# EAGLE design CC3-MPI-26-3124-Satellite-Board-CoCo-3-Upgrade-2009-V1RA (EAGLE 5.10)
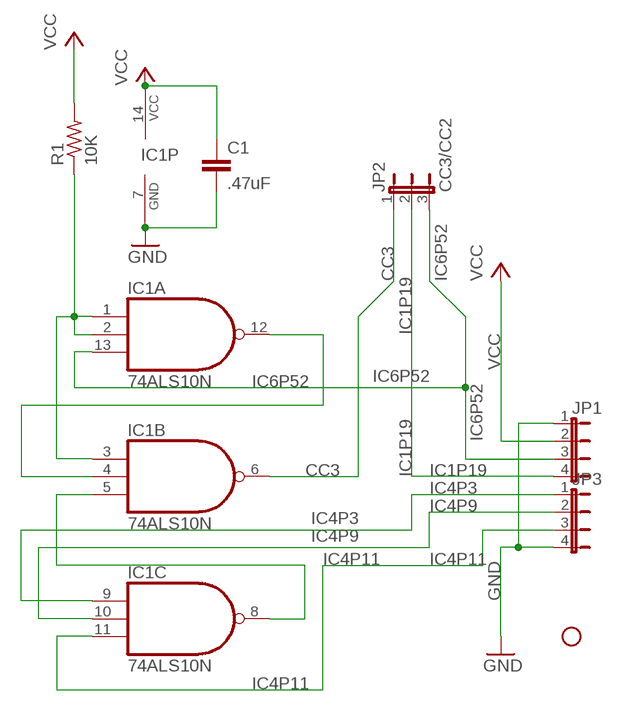
[diagram p0: schematic, sheet 1]

## Parts
C1  .47uF  C2.5/4  [C2.5-4]
IC1  74ALS10N  [DIL14-3]
JP1  JP4E  [JP4]
JP2  CC3/CC2  JP2E  [JP2]
JP3  JP4E  [JP4]
R1  10K  R-US_0207/7  [0207/7]
U$1  SPARKFUN_STAND-OFF  [SPARKFUN_STAND-OFF]

## Nets
CC3: IC1.6(B:O) JP2.1
GND [power]: C1.2 IC1.7(P:GND) JP1.1 JP3.4
IC1P19: JP1.4 JP2.2
IC4P3: IC1.9(C:I0) JP3.1
IC4P9: IC1.10(C:I1) JP3.2
IC4P11: IC1.11(C:I2) JP3.3
IC6P52: IC1.13(A:I2) JP1.3 JP2.3
N$6: IC1.1(A:I0) IC1.2(A:I1) IC1.3(B:I0) R1.1
N$8: IC1.4(B:I1) IC1.12(A:O)
N$9: IC1.5(B:I2) IC1.8(C:O)
VCC [power]: C1.1 IC1.14(P:VCC) JP1.2 R1.2

## Library data of the parts
C1 = capacitor-wima:C: CAPACITOR naming: grid - package width
IC1 = RetroZilla.org-74xx-us:74*10: Triple 3-input NAND gate
JP1 JP3 = jumper:JP4E: JUMPER
JP2 = jumper:JP2E: JUMPER
R1 = rcl-2:R-US_: RESISTOR, American symbol
U$1 = FDC:SPARKFUN_STAND-OFF: Stand Off This is the mechanical footprint for a #4 phillips button head screw. Use the keepout ring to avoid running the screw head into surrounding components. SKU : PRT-00447

## Net classes
0 default: width 0.203 mm, clearance 0.152 mm
1 power: width 0.762 mm, clearance 0.203 mm

## Board
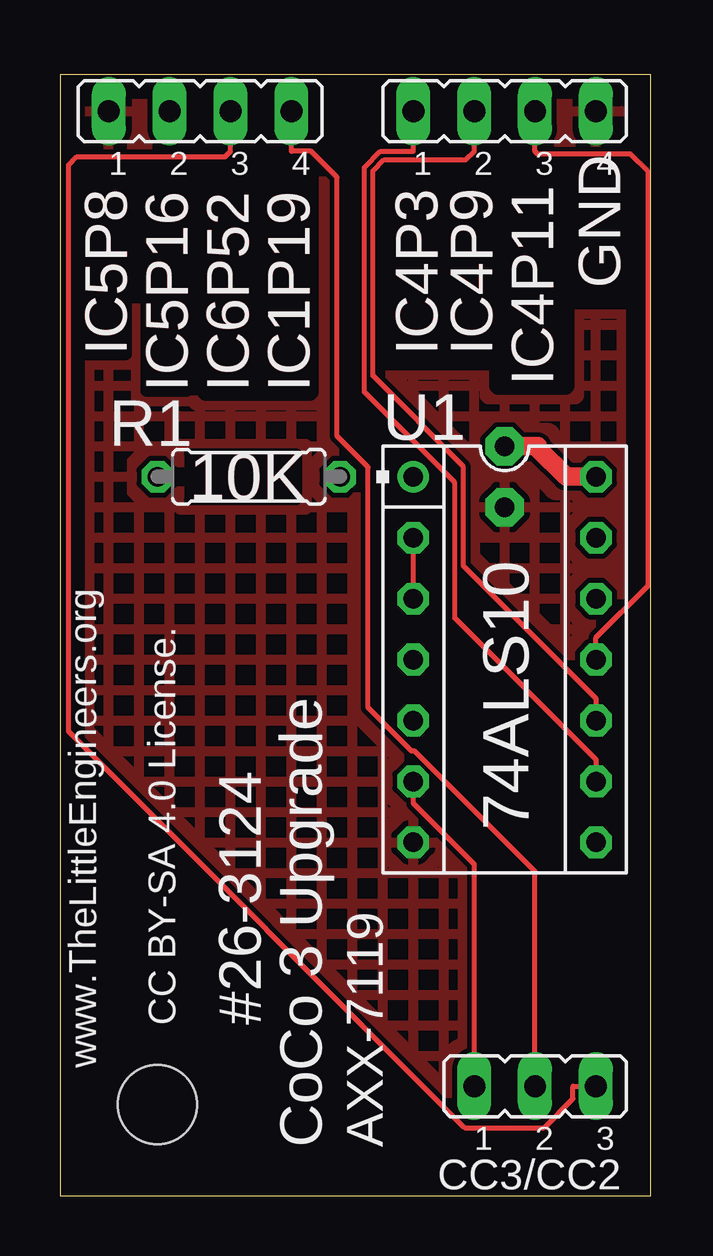
[diagram p1: board, top side]
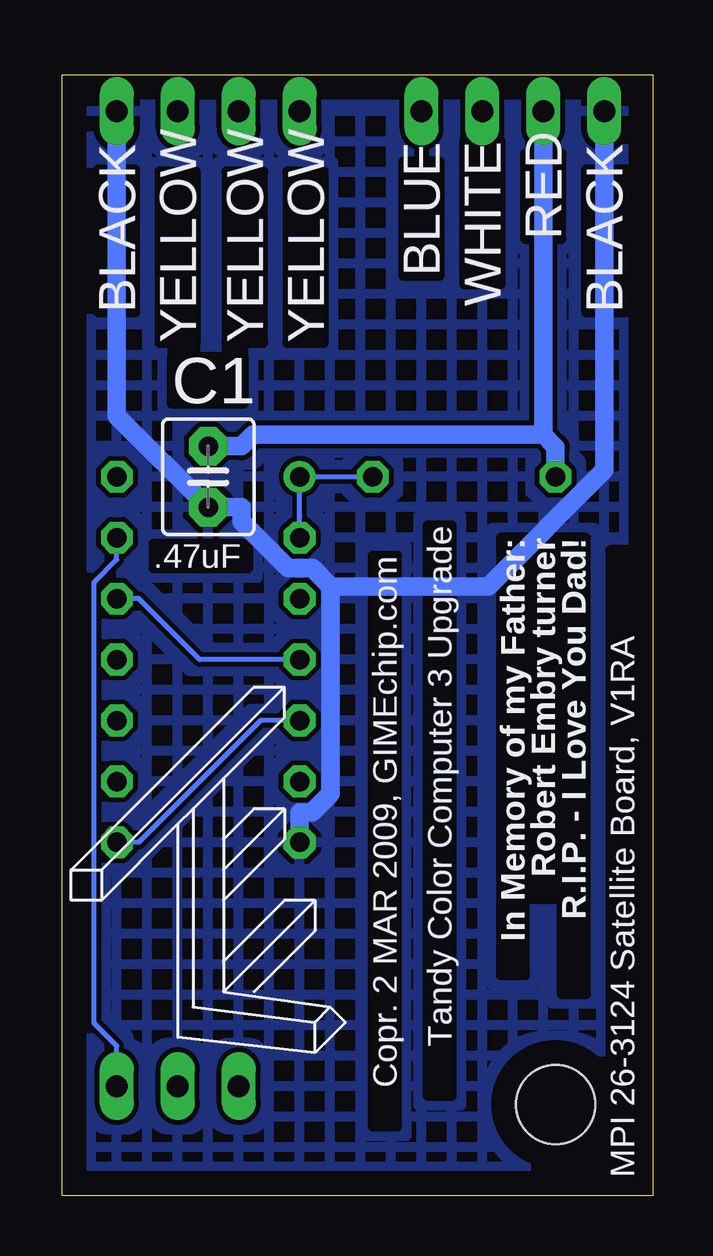
[diagram p2: board, bottom side, seen from below]

Size 24.64 x 46.74 mm. Coordinates in mm from the lower left corner, seen from the top.
Outline: 0,46.74 0,0 24.64,0 24.64,46.74 0,46.74
Copper layers (1*16): Top 0.035mm / dielectric 1.5mm / Bottom 0.035mm
Design rules "default": minimum track width 10mil, minimum drill 24mil, track to track 8mil, track to pad 8mil, pad to pad 8mil, via to via 8mil, smd to smd 8mil, copper to edge 40mil, drill to drill 8mil, minimum pad ring 10mil, minimum via ring 8mil, stop-mask expansion 4mil, vias tented up to drill 0mil, thermal gap 10mil
tRestrict: area 1,33.5 to 10.4,42.7; area 13.7,33.8 to 23.9,42.4

### Footprints (pad centres in the part's own frame; a part is rotated, then mirrored left to right if it is on the bottom)
C2.5-4 = drill 0.813 pad 1.6 octagon: 1 -1.27,0; 2 1.27,0
DIL14-3 = drill 0.813 round: 1 -7.62,-3.81 | drill 0.813 octagon: 2 -5.08,-3.81; 3 -2.54,-3.81; 4 0,-3.81; 5 2.54,-3.81; 6 5.08,-3.81; 7 7.62,-3.81; 8 7.62,3.81; 9 5.08,3.81; 10 2.54,3.81; 11 0,3.81; 12 -2.54,3.81; 13 -5.08,3.81; 14 -7.62,3.81
JP4 = drill 0.914 long: 1 -3.81,0; 2 -1.27,0; 3 1.27,0; 4 3.81,0
JP2 = drill 0.914 long: 1 -2.54,0; 2 0,0; 3 2.54,0
0207/7 = drill 0.813 octagon: 1 -3.81,0; 2 3.81,0
SPARKFUN_STAND-OFF = hole 3.302: 0,0

### Placement (x,y rotation side)
C1  18.54,29.97 270 bottom
IC1  18.54,22.35 270 top
JP1  5.84,45.21 0 top
JP2  19.81,4.57 0 top
JP3  18.54,45.21 0 top
R1  7.87,29.97 180 top
U$1  4.06,3.81 0 top
U$2  [TLE-LOGO-13]  19.81,6.6 0 bottom

### Tracks (layer width: path | path; a pad name or v marks a point on that pad's centre or on a via)
CC3
  Top 0.203: IC1.6 14.73,16.36 17.27,13.82 JP2.1
GND
  Bottom 0.762: 13.44,25.4 13.44,16.76 14.22,15.98 14.73,15.98 IC1.7 | 13.44,25.4 14.19,26.16 15.22,26.16 17.16,28.1 17.16,28.7 C1.2 22.35,32.51 JP3.4 | JP1.1 2.03,30.24 6.87,25.4 13.44,25.4
  pour Top (hatched): -0.51,47.75 24.89,47.75 24.89,-0.51 -0.51,-0.51
  pour Bottom (hatched): -0.51,47.75 24.89,47.75 24.89,-0.51 -0.51,-0.51
IC1P19
  Top 0.203: JP1.4 9.65,43.54 10.48,43.54 11.56,42.45 11.56,31.67 12.85,30.37 12.85,20.36 14.66,18.54 14.79,18.54 19.81,13.52 JP2.2
IC4P3
  Top 0.203: IC1.9 22.35,18.19 16.46,24.07 16.46,29.73 12.69,33.5 12.69,42.86 13.37,43.54 14.73,43.54 JP3.1
IC4P9
  Top 0.203: IC1.10 22.35,20.73 16.82,26.26 16.82,30.41 13.05,34.18 13.05,42.71 13.52,43.18 16.92,43.18 17.27,43.54 JP3.2
IC4P11
  Top 0.203: IC1.11 22.35,23.27 24.52,25.44 24.52,42.68 23.78,43.42 19.93,43.42 19.81,43.54 JP3.3
IC6P52
  Top 0.203: JP2.3 21.39,4.57 21.39,4.04 20.19,2.85 16.87,2.85 0.36,19.36 0.36,42.96 0.71,43.31 6.88,43.31 7.11,43.54 JP1.3
  Bottom 0.203: IC1.13 22.35,26.52 23.3,25.57 23.3,7.2 22.35,6.25 JP2.3
N$6
  Top 0.203: IC1.3 IC1.2
  Bottom 0.203: IC1.2 14.73,28.35 IC1.1 R1.1
N$8
  Bottom 0.203: IC1.12 21.44,24.89 18.9,22.35 IC1.4
N$9
  Bottom 0.203: IC1.8 21.44,14.73 16.36,19.81 IC1.5
VCC
  Top 0.762: C1.1 19.93,31.24 19.93,31.15 21.11,29.97 IC1.14
  Bottom 0.762: C1.1 17.16,31.24 16.68,31.72 4.57,31.72 | 4.57,31.72 JP1.2 | 4.57,31.72 4.06,31.22 R1.2

### Text on the board
Top: GND | IC5P8 | IC4P3 | IC4P9 | IC5P16 | IC6P52 | IC1P19 | IC4P11 | 10K
Bottom: WHITE | RED | BLUE | BLACK | BLACK | YELLOW | YELLOW | YELLOW | C1 | R.I.P. - I Love You Dad! | Robert Embry turner | In Memory of my Father: | Tandy Color Computer 3 Upgrade | Copr. 2 MAR 2009, GIMEchip.com | .47uF | MPI 26-3124 Satellite Board, V1RA
tPlace: GND | IC5P8 | IC4P3 | IC4P9 | IC5P16 | IC6P52 | IC1P19 | IC4P11 | R1 | U1 | 10K | 74ALS10 | CC BY-SA 4.0 License. | www.TheLittleEngineers.org | AXX-7119
bPlace: WHITE | RED | BLUE | BLACK | BLACK | YELLOW | YELLOW | YELLOW | C1 | R.I.P. - I Love You Dad! | Robert Embry turner | In Memory of my Father: | Tandy Color Computer 3 Upgrade | Copr. 2 MAR 2009, GIMEchip.com | .47uF | MPI 26-3124 Satellite Board, V1RA
_tsilk: #26-3124 | CoCo 3 Upgrade